# EAGLE schematic IR_Conditioning_Circuit (EAGLE 9.3.0)
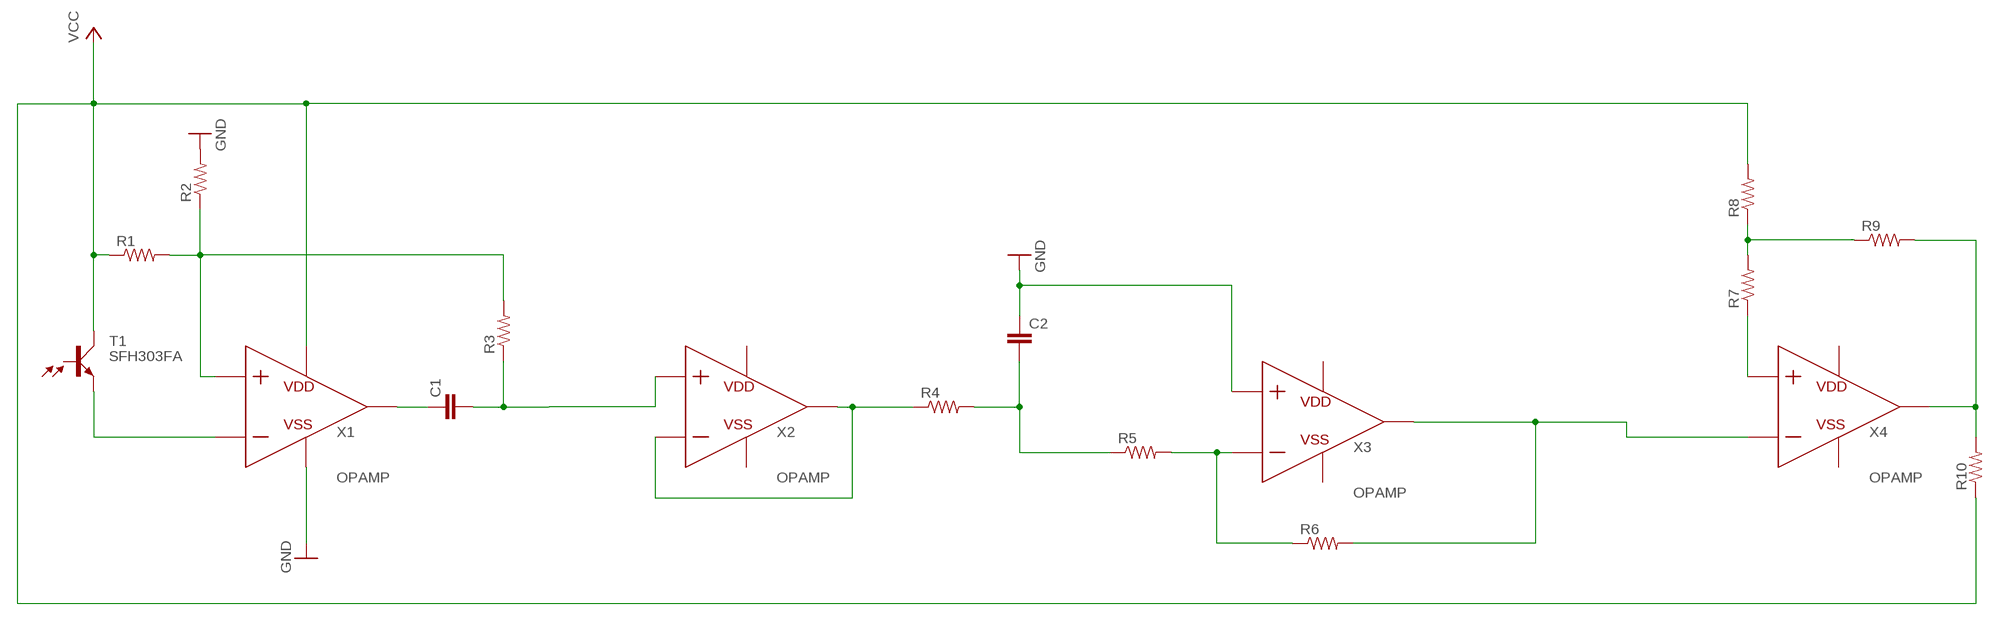
[diagram p0: schematic, sheet 1]

## Parts
C1  C2,5-3  [C2.5-3]
C2  C2,5-3  [C2.5-3]
R1  R-US_0204/2V  [0204V]
R2  R-US_0204/2V  [0204V]
R3  R-US_0204/2V  [0204V]
R4  R-US_0204/2V  [0204V]
R5  R-US_0204/2V  [0204V]
R6  R-US_0204/2V  [0204V]
R7  R-US_0204/2V  [0204V]
R8  R-US_0204/2V  [0204V]
R9  R-US_0204/2V  [0204V]
R10  R-US_0204/2V  [0204V]
T1  SFH303FA  [SFH303]
X1  OPAMP  (no package)
X2  OPAMP  (no package)
X3  OPAMP  (no package)
X4  OPAMP  (no package)

## Nets
GND: C2.1 R2.2 X1.VSS X3.P
N$1: T1.1(E) X1.N
N$2: R1.2 R2.1 R3.2 X1.P
N$3: C1.1 X1.VOUT
N$4: C1.2 R3.1 X2.P
N$5: R4.1 X2.N X2.VOUT
N$6: C2.2 R4.2 R5.1
N$7: R5.2 R6.1 X3.N
N$9: R6.2 X3.VOUT X4.N
N$10: R7.1 X4.P
N$11: R7.2 R8.1 R9.1
N$13: R9.2 R10.2 X4.VOUT
VCC: R1.1 R8.2 R10.1 T1.2(C) X1.VDD
Unconnected: T1.3(B) X2.VDD X2.VSS X3.VDD X3.VSS X4.VDD X4.VSS

## Library data of the parts
C1 C2 = capacitor-wima:C: CAPACITOR naming: grid - package width
R1-R10 = rcl:R-US_: RESISTOR, American symbol; SPICEPREFIX: R
T1 = opto-trans-siemens:SFH303: Silicium NPN Phototransistor Source: Siemens; OC_FARNELL: unknown; OC_NEWARK: unknown
X1-X4 = ngspice-simulation:OPAMP: Operational amplifier with power pins